# EAGLE design MRCS-8xDPDT-Relay (EAGLE 7.7.0)
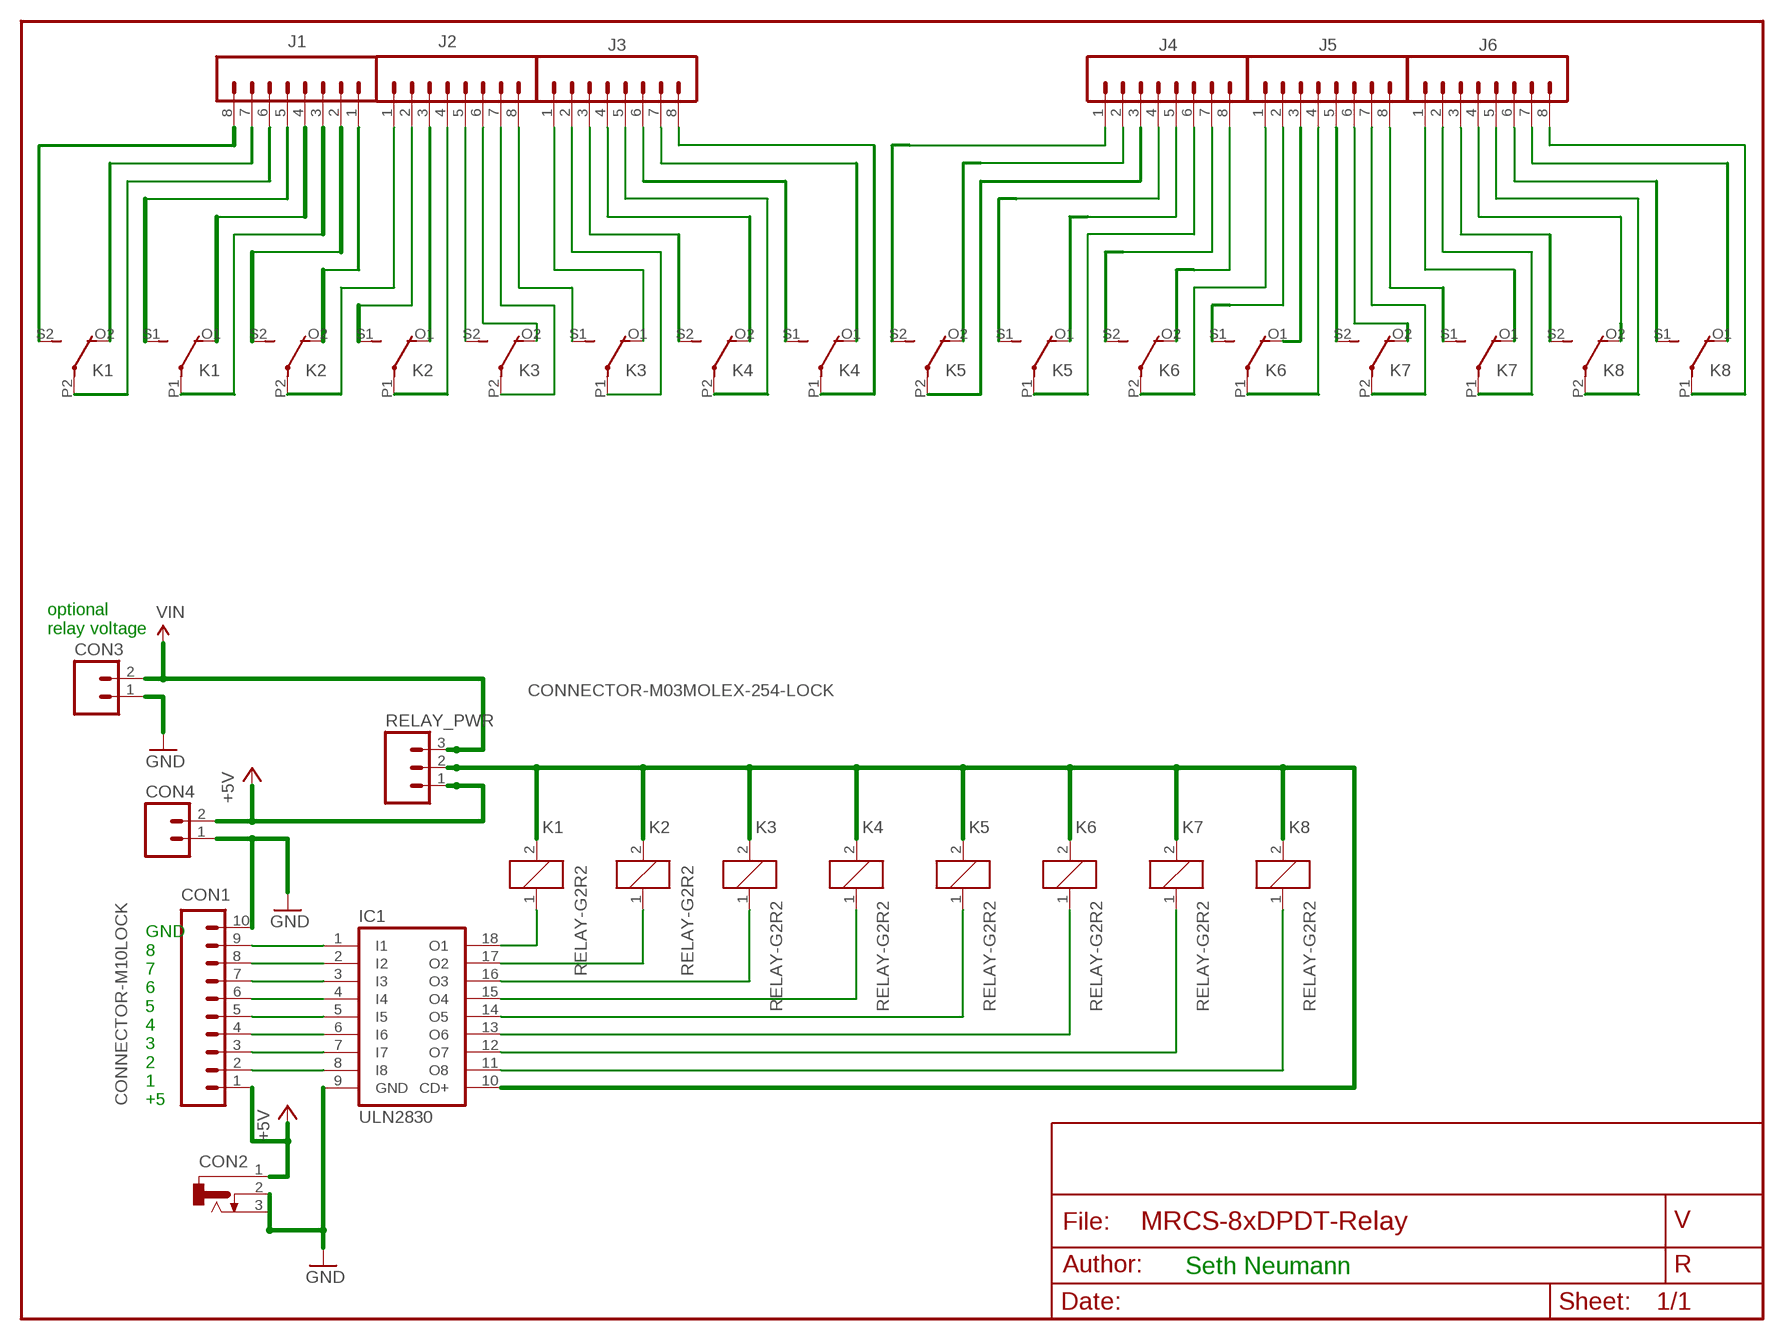
[diagram p0: schematic, sheet 1]

## Parts
CON1  CONNECTOR-M10LOCK  [1X10_LOCK]
CON2  CONNECTOR-DC-POWER-RA  [DCJ0202]
CON3  CONNECTOR-M023.5MM-LOCK  [SCREWTERMINAL-3.5MM-2_LOCK]
CON4  CONNECTOR-M023.5MM-LOCK  [SCREWTERMINAL-3.5MM-2_LOCK]
IC1  ULN2830  ULN2803A  [DIL18]
J1  CONNECTOR-M08LOCK  [1X08_LOCK]
J2  CONNECTOR-M08LOCK  [1X08_LOCK]
J3  CONNECTOR-M08LOCK  [1X08_LOCK]
J4  CONNECTOR-M08LOCK  [1X08_LOCK]
J5  CONNECTOR-M08LOCK  [1X08_LOCK]
J6  CONNECTOR-M08LOCK  [1X08_LOCK]
K1  RELAY-G2R2  [G2R2]
K2  RELAY-G2R2  [G2R2]
K3  RELAY-G2R2  [G2R2]
K4  RELAY-G2R2  [G2R2]
K5  RELAY-G2R2  [G2R2]
K6  RELAY-G2R2  [G2R2]
K7  RELAY-G2R2  [G2R2]
K8  RELAY-G2R2  [G2R2]
RELAY_PWR  CONNECTOR-M03MOLEX-254-LOCK  [MOLEX-1X3_LOCK]

## Nets
+5V: CON1.1 CON2.1 CON4.2(B) RELAY_PWR.1
GND: CON1.10 CON2.2 CON2.3 CON3.1(A) CON4.1(A) IC1.9(GND)
N$1: CON1.9 IC1.1(I1)
N$2: CON1.8 IC1.2(I2)
N$3: CON1.7 IC1.3(I3)
N$4: CON1.6 IC1.4(I4)
N$5: CON1.5 IC1.5(I5)
N$6: CON1.4 IC1.6(I6)
N$7: CON1.3 IC1.7(I7)
N$8: CON1.2 IC1.8(I8)
N$9: IC1.17(O2) K2.1
N$10: IC1.16(O3) K3.1
N$11: IC1.15(O4) K4.1
N$12: IC1.14(O5) K5.1
N$13: IC1.18(O1) K1.1
N$14: IC1.13(O6) K6.1
N$15: IC1.12(O7) K7.1
N$16: IC1.11(O8) K8.1
N$17: IC1.10(CD+) K1.2 K2.2 K3.2 K4.2 K5.2 K6.2 K7.2 K8.2 RELAY_PWR.2
N$18: J1.8 K1.S2(3:S)
N$19: J1.7 K1.O2(3:O)
N$20: J1.6 K1.P2(3:P)
N$21: J1.5 K1.S1(2:S)
N$22: J2.3 K2.O1(2:O)
N$23: J1.3 K1.P1(2:P)
N$24: J1.2 K2.S2(3:S)
N$25: J1.1 K2.O2(3:O)
N$26: J2.1 K2.P2(3:P)
N$27: J2.2 K2.S1(2:S)
N$28: J4.3 K5.P2(3:P)
N$29: J2.4 K2.P1(2:P)
N$30: J2.7 K3.P2(3:P)
N$31: J2.6 K3.O2(3:O)
N$32: J2.8 K3.S1(2:S)
N$33: J2.5 K3.S2(3:S)
N$34: J3.1 K3.O1(2:O)
N$35: J3.2 K3.P1(2:P)
N$36: J3.3 K4.S2(3:S)
N$37: J3.4 K4.O2(3:O)
N$38: J3.5 K4.P2(3:P)
N$39: J3.6 K4.S1(2:S)
N$40: J3.7 K4.O1(2:O)
N$41: J3.8 K4.P1(2:P)
N$42: J5.4 K6.P1(2:P)
N$43: J5.5 K7.S2(3:S)
N$44: J5.6 K7.O2(3:O)
N$45: J5.7 K7.P2(3:P)
N$46: J5.8 K7.S1(2:S)
N$47: J6.1 K7.O1(2:O)
N$48: J6.2 K7.P1(2:P)
N$49: J6.3 K8.S2(3:S)
N$50: J6.4 K8.O2(3:O)
N$51: J6.5 K8.P2(3:P)
N$52: J6.6 K8.S1(2:S)
N$53: J6.7 K8.O1(2:O)
N$54: J6.8 K8.P1(2:P)
N$55: J5.3 K6.O1(2:O)
N$56: J5.2 K6.S1(2:S)
N$57: J5.1 K6.P2(3:P)
N$58: J4.8 K6.O2(3:O)
N$59: J4.7 K6.S2(3:S)
N$60: J4.6 K5.P1(2:P)
N$61: J4.5 K5.O1(2:O)
N$62: J4.4 K5.S1(2:S)
N$64: J4.2 K5.O2(3:O)
N$65: J4.1 K5.S2(3:S)
N$66: J1.4 K1.O1(2:O)
VIN: CON3.2(B) RELAY_PWR.3

## Notes on the sheet
- optional 
  relay voltage
- GND
  8
  7
  6
  5
  4
  3
  2
  1
  +5
- Seth Neumann

## Library data of the parts
CON1 = SPCoast:CONNECTOR-M10: Header 10 Standard 10-pin 0.1" header. Use with straight break away headers (SKU : PRT-00116), right angle break away headers (PRT-00553), swiss pins (PRT-00743), machine pins (PRT-00117), and female headers (PRT-00115).
CON2 = SPCoast:CONNECTOR-DC-POWER: DC POWER JACK
CON3 CON4 = SPCoast:CONNECTOR-M02: PHOENIX CONNECTOR
IC1 = MRCS:ULN2803A: DRIVER ARRAY
J1-J6 = SPCoast:CONNECTOR-M08: Header 8 Standard 8-pin 0.1" header. Use with straight break away headers (SKU : PRT-00116), right angle break away headers (PRT-00553), swiss pins (PRT-00743), machine pins (PRT-00117), and female headers (PRT-00115).
K1-K8 = SPCoast:RELAY-G2R2: RELAY 2 x switch, Omron; MF: OMRON COMPONENTS USA; MPN: G2R-2-DC6; OC_FARNELL: unknown; OC_NEWARK: 89C5317
RELAY_PWR = SPCoast:CONNECTOR-M03

## Board
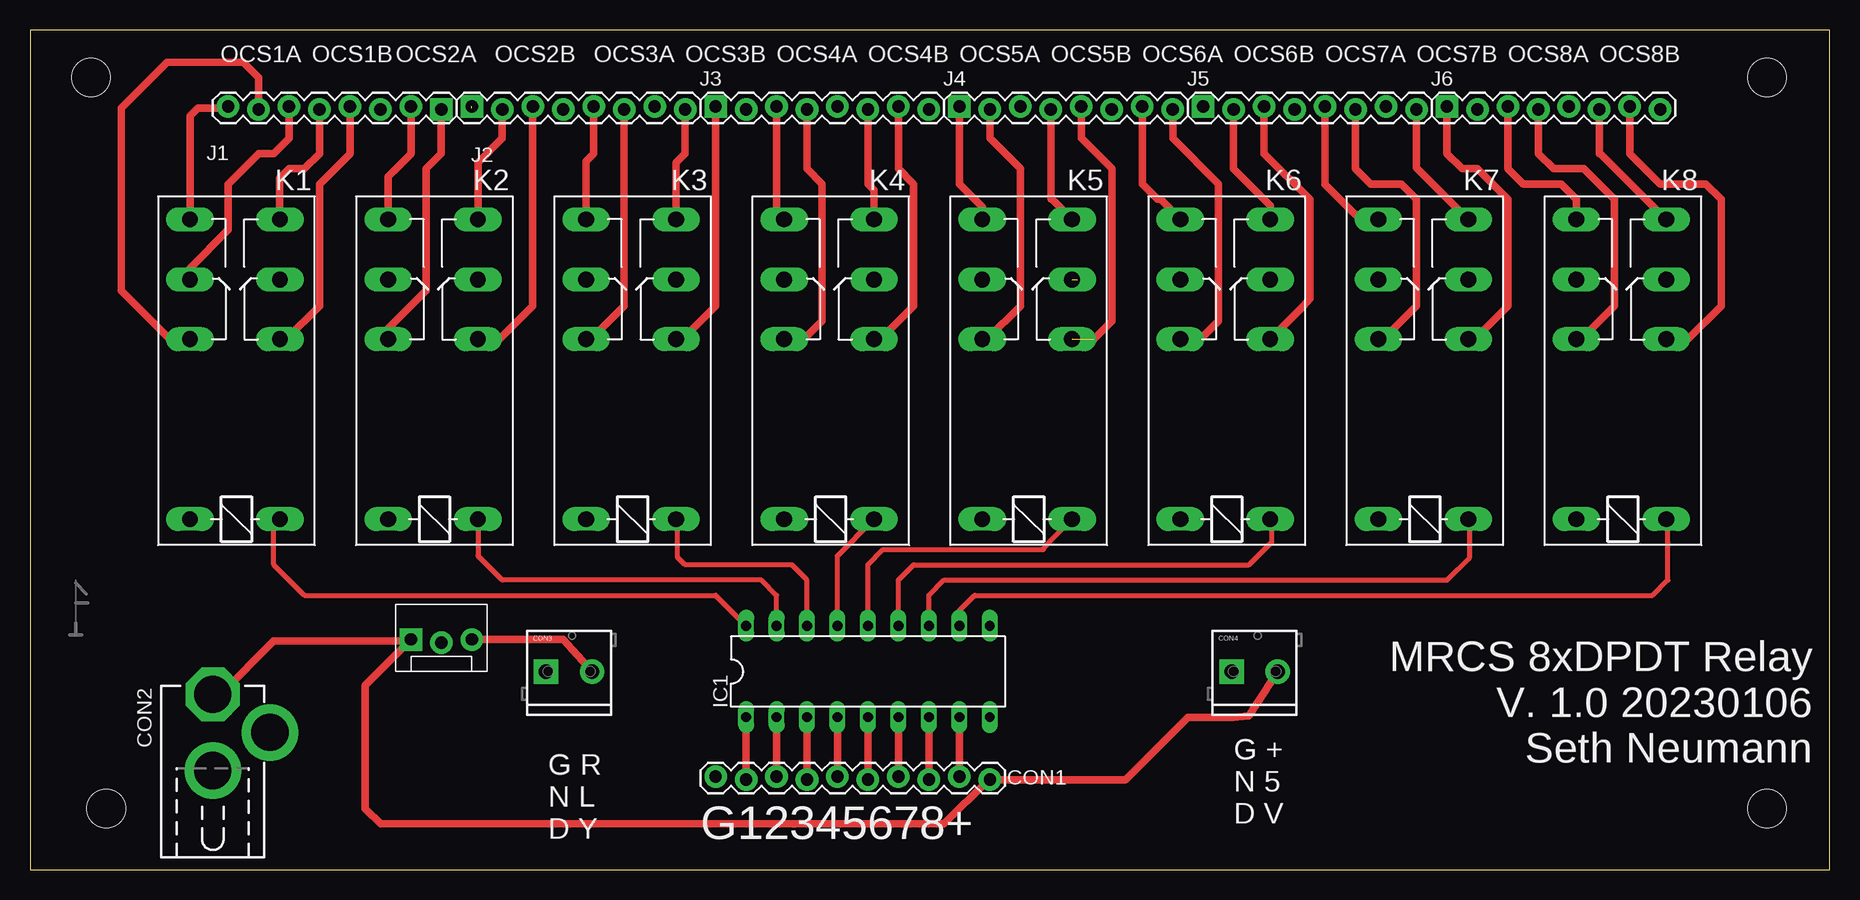
[diagram p1: board, top side]
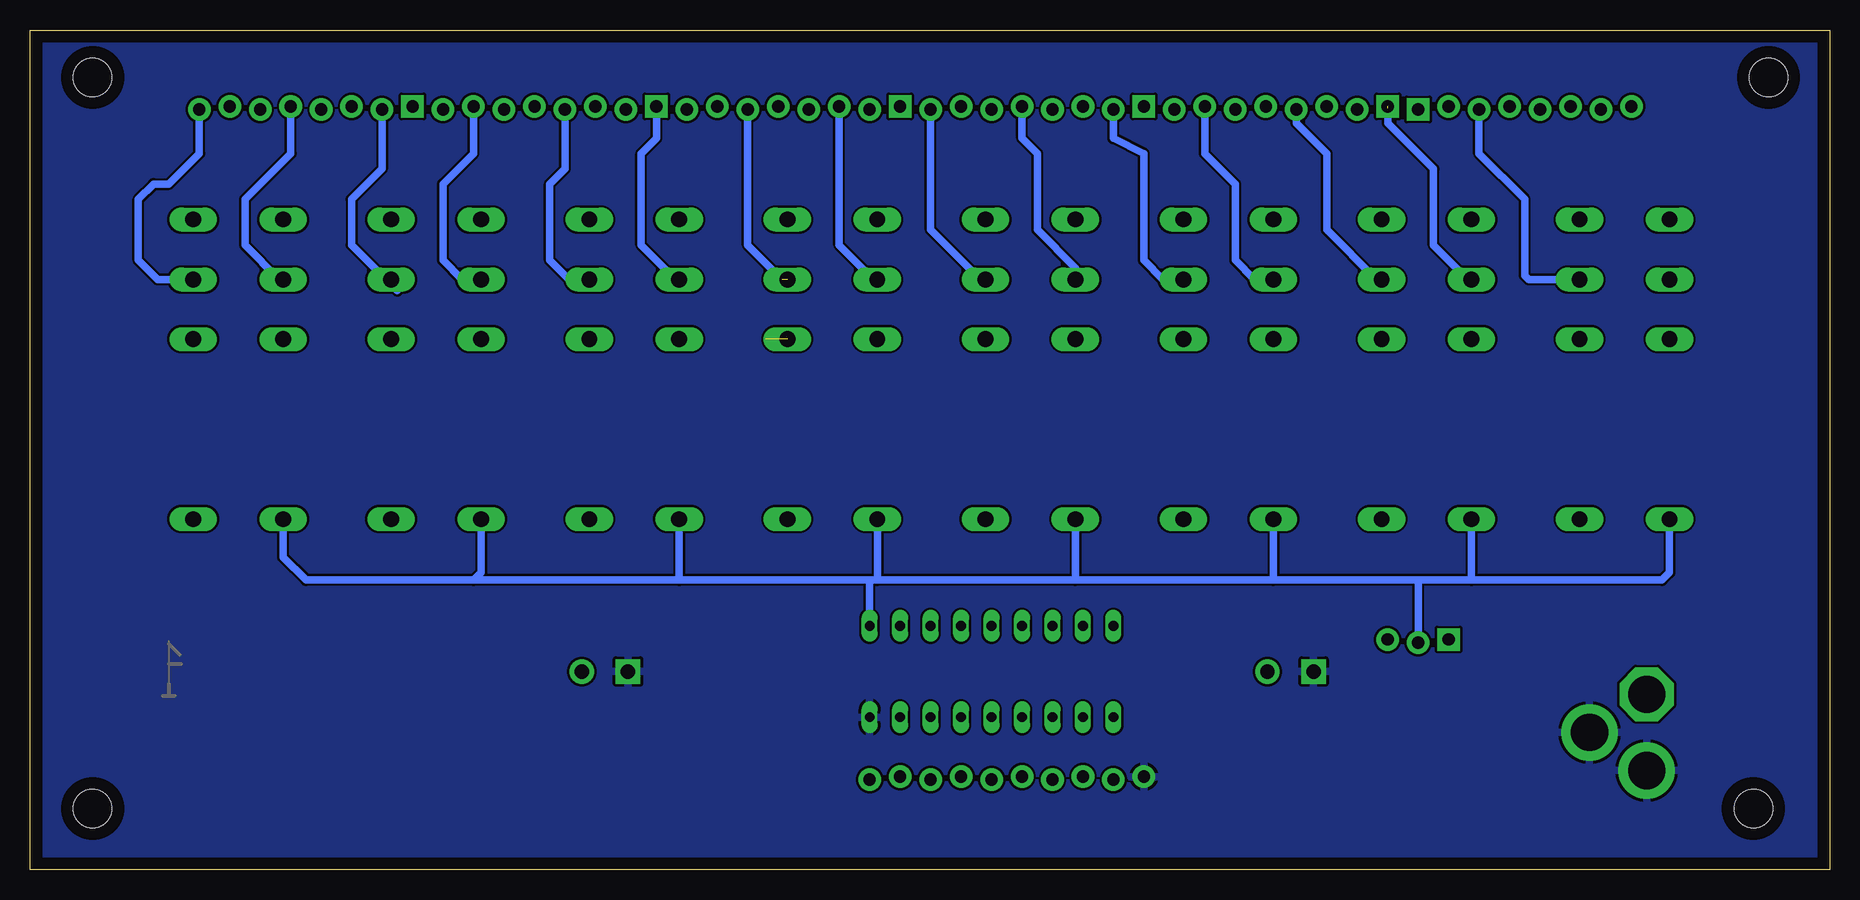
[diagram p2: board, bottom side, seen from below]

Size 150 x 70 mm. Coordinates in mm from the lower left corner, seen from the top.
Outline: 0,0 150,0 150,70 0,70 0,0
Copper layers (1*16): Top 0.035mm / dielectric 1.5mm / Bottom 0.035mm
Design rules "default": minimum track width 10mil, minimum drill 24mil, track to track 8mil, track to pad 8mil, pad to pad 8mil, via to via 8mil, smd to smd 8mil, copper to edge 40mil, drill to drill 8mil, minimum pad ring 10mil, minimum via ring 8mil, stop-mask expansion 4mil, vias tented up to drill 0mil, thermal gap 10mil
Holes 3.2 mm at 5.08,66.04 6.35,5.08 144.78,5.08 144.78,66.04

### Footprints (pad centres in the part's own frame; a part is rotated, then mirrored left to right if it is on the bottom)
1X10_LOCK = drill 1.016 pad 1.88: 1 0,0.127; 2 2.54,-0.127; 3 5.08,0.127; 4 7.62,-0.127; 5 10.16,0.127; 6 12.7,-0.127; 7 15.24,0.127; 8 17.78,-0.127; 9 20.32,0.127; 10 22.86,-0.127
DCJ0202 = drill 3.1 pad 4.5 octagon: 1 0,3.175 | drill 3.1 pad 4.7: 2 4.763,0; 3 0,-3.175
SCREWTERMINAL-3.5MM-2_LOCK = drill 1.2 pad 2.032 square: 1 -0.178,0 | drill 1.2 pad 2.032: 2 3.678,0
DIL18 = drill 0.813 long: 1 -10.16,-3.81; 2 -7.62,-3.81; 3 -5.08,-3.81; 4 -2.54,-3.81; 5 0,-3.81; 6 2.54,-3.81; 7 5.08,-3.81; 8 7.62,-3.81; 9 10.16,-3.81; 10 10.16,3.81; 11 7.62,3.81; 12 5.08,3.81; 13 2.54,3.81; 14 0,3.81; 15 -2.54,3.81; 16 -5.08,3.81; 17 -7.62,3.81; 18 -10.16,3.81
1X08_LOCK = drill 1.016 pad 1.88 square: 1 0,0.127 | drill 1.016 pad 1.88: 2 2.54,-0.127; 3 5.08,0.127; 4 7.62,-0.127; 5 10.16,0.127; 6 12.7,-0.127; 7 15.24,0.127; 8 17.78,-0.127
G2R2 = drill 1.321 long: 1 -11.43,-3.683; 2 -11.43,3.81; O1 3.581,-3.683; O2 3.581,3.81; P1 8.56,-3.683; P2 8.56,3.81; S1 13.564,-3.683; S2 13.564,3.81
MOLEX-1X3_LOCK = drill 1.016 pad 1.88 square: 1 0,0.127 | drill 1.016 pad 1.88: 2 2.54,-0.127; 3 5.08,0.127

### Placement (x,y rotation side)
CON1  80.01,7.62 180 top
CON2  15.24,11.43 0 top
CON3  43.18,16.51 0 top
CON4  100.33,16.51 0 top
IC1  69.85,16.51 0 top
J1  34.29,63.5 180 top
J2  36.83,63.5 0 top
J3  57.15,63.5 0 top
J4  77.47,63.5 0 top
J5  97.79,63.5 0 top
J6  118.11,63.5 0 top
K1  17.14,40.64 90 top
K2  33.66,40.64 90 top
K3  50.16,40.64 90 top
K4  66.67,40.64 90 top
K5  83.19,40.64 90 top
K6  99.69,40.64 90 top
K7  116.2,40.64 90 top
K8  132.72,40.64 90 top
RELAY_PWR  31.75,19.05 0 top
U$1  [CA-PROP65WARNING]  109.22,8.89 0 top
U$2  [MRCSLOGOBTM]  132.08,13.97 0 top
U$3  [MRCSLOGOTOP]  2.54,19.05 0 top

### Tracks (layer width: path | path; a pad name or v marks a point on that pad's centre or on a via)
+5V
  Top 0.61: CON4.2 101.6,12.83 100.33,12.7 96.52,12.7 91.31,7.49 CON1.1 79.88,7.49 76.2,3.81 29.21,3.81 27.94,5.08 27.94,15.37 RELAY_PWR.1 31.62,19.05 20.32,19.05 15.88,14.61 CON2.1
GND
  pour Bottom: 0,0 149.86,0 149.86,69.85 0,69.85
  pour Bottom (isolate 0.254): 0,0 149.86,0 149.86,69.85 0,69.85
N$1
  Top 0.61: IC1.1 CON1.9
N$2
  Top 0.61: IC1.2 CON1.8
N$3
  Top 0.61: IC1.3 CON1.7
N$4
  Top 0.61: IC1.4 CON1.6
N$5
  Top 0.61: IC1.5 CON1.5
N$6
  Top 0.61: IC1.6 CON1.4
N$7
  Top 0.61: IC1.7 CON1.3
N$8
  Top 0.61: IC1.8 CON1.2
N$9
  Top 0.406: K2.1 37.34,26.16 39.37,24.13 60.96,24.13 62.23,22.86 IC1.17
N$10
  Top 0.406: K3.1 53.98,29.08 53.98,26.04 54.61,25.4 63.5,25.4 64.77,24.13 IC1.16
N$11
  Top 0.406: IC1.15 67.31,26.16 K4.1
N$12
  Top 0.406: IC1.14 69.85,25.4 71.12,26.67 84.45,26.67 85.09,27.43 K5.1
N$13
  Top 0.406: K1.1 20.32,28.7 20.32,25.4 22.86,22.86 57.15,22.86 IC1.18
N$14
  Top 0.406: IC1.13 72.39,24.13 73.66,25.4 101.6,25.4 103.5,27.3 103.5,29.08 K6.1
N$15
  Top 0.406: IC1.12 74.93,22.86 76.2,24.13 118.11,24.13 120.02,26.04 120.02,29.08 K7.1
N$16
  Top 0.406: IC1.11 77.47,21.59 78.74,22.86 135.25,22.86 136.53,24.13 136.53,29.08 K8.1
N$17
  Bottom 0.61: K1.2 13.34,24.77 13.97,24.13 29.84,24.13 | 29.84,24.13 34.29,24.13 | 34.29,24.13 46.35,24.13 | 46.35,24.13 62.87,24.13 | 62.87,24.13 79.38,24.13 | 79.38,24.13 80.01,24.13 | 80.01,24.13 95.89,24.13 | 95.89,24.13 113.03,24.13 | 113.03,24.13 127,24.13 128.91,26.04 K8.2 | K7.2 112.39,24.77 113.03,24.13 | K6.2 95.89,24.13 | K5.2 79.38,24.13 | IC1.10 80.01,24.13 | K4.2 62.87,24.13 | 46.99,29.21 K3.2 46.35,24.13 | RELAY_PWR.2 34.29,24.13 | K2.2 29.84,24.13
N$18
  Top 0.61: K1.S2 13.34,62.87 13.97,63.5 16.38,63.5 J1.8
N$19
  Top 0.61: K1.O2 11.66,44.22 7.62,48.26 7.62,63.5 11.43,67.31 17.78,67.31 19.05,66.04 J1.7
N$20
  Top 0.61: K1.P2 13.34,50.16 16.51,53.34 16.51,57.15 19.05,59.69 20.32,59.69 21.59,60.96 J1.6
N$21
  Top 0.61: K1.S1 20.83,57.66 21.59,58.42 22.86,58.42 24.13,59.69 J1.5
N$22
  Top 0.61: K2.O1 39.14,44.22 41.91,46.99 J2.3
N$23
  Bottom 0.61: K1.P1 25.07,49.2 25.4,49.53 25.4,55.88 29.21,59.69 J1.3
N$24
  Top 0.61: K2.S2 29.84,57.78 31.75,59.69 J1.2
N$25
  Top 0.61: K2.O2 29.84,45.09 33.02,48.26 33.02,58.42 34.29,59.69 J1.1
N$26  (1 unrouted)
  Bottom 0.61: K2.P2 30.15,49.2 33.02,52.07 33.02,58.42 36.83,62.23 36.83,63.5
N$27
  Top 0.61: K2.S1 37.34,58.93 39.37,60.96 J2.2
N$28
  Bottom 0.61: K5.P2 79.68,49.2 82.55,52.07 J4.3
N$29
  Bottom 0.61: K2.P1 37.77,49.2 41.91,53.34 41.91,59.69 44.45,62.23 J2.4
N$30
  Bottom 0.61: K3.P2 47.93,49.2 49.53,50.8 49.53,57.15 52.07,59.69 J2.7
N$31
  Top 0.61: K3.O2 46.76,44.22 49.53,46.99 J2.6
N$32
  Top 0.61: K3.S1 53.85,58.93 54.61,59.69 J2.8
N$33
  Top 0.61: K3.S2 46.35,59.05 46.99,59.69 J2.5
N$34
  Top 0.61: K3.O1 54.38,44.22 57.15,46.99 J3.1
N$35
  Bottom 0.61: K3.P1 55.55,49.2 57.15,50.8 57.15,59.69 59.69,60.96 J3.2
N$36
  Top 0.61: J3.3 62.23,54.84 K4.S2
N$37
  Top 0.61: K4.O2 64.54,44.22 66.04,45.72 66.04,57.15 64.77,58.42 J3.4
N$38
  Bottom 0.61: K4.P2 62.87,50.16 66.04,53.34 66.04,59.69 67.31,60.96 J3.5
N$39
  Top 0.61: K4.S1 70.36,56.64 69.85,57.15 J3.6
N$40
  Top 0.61: K4.O1 70.89,44.22 73.66,46.99 73.66,57.15 72.39,58.42 J3.7
N$41
  Bottom 0.61: K4.P1 70.79,49.2 74.93,53.34 J3.8
N$42
  Bottom 0.61: K6.P1 105.08,49.2 106.68,50.8 106.68,57.15 105.41,58.42 J5.4
N$43
  Top 0.61: J5.5 107.95,57.15 110.49,54.61 111.99,54.61 K7.S2
N$44
  Top 0.61: K7.O2 112.8,44.22 115.57,46.99 115.57,55.88 114.3,57.15 111.76,57.15 110.49,58.42 J5.6
N$45
  Bottom 0.61: K7.P2 113.97,49.2 115.57,50.8 115.57,57.15 113.03,59.69 J5.7
N$46
  Top 0.61: J5.8 115.57,58.52 K7.S1
N$47
  Top 0.61: K7.O1 120.42,44.22 123.19,46.99 123.19,55.88 120.65,58.42 119.38,58.42 118.11,59.69 J6.1
N$48
  Bottom 0.61: J6.2 120.65,58.42 123.19,55.88 123.19,52.07 119.38,48.26 119.38,48.69 K7.P1
N$49
  Top 0.61: J6.3 123.19,58.42 124.46,57.15 127.64,57.15 128.91,55.88 K8.S2
N$50
  Top 0.61: K8.O2 129.31,44.22 132.08,46.99 132.08,55.88 129.54,58.42 127,58.42 125.73,59.69 J6.4
N$51
  Bottom 0.61: K8.P2 129.21,49.2 132.08,52.07 132.08,55.88 128.27,59.69 J6.5
N$52
  Top 0.61: J6.6 130.81,59.69 130.91,59.69 K8.S1
N$53
  Top 0.61: K8.O1 138.2,44.22 140.97,46.99 140.97,55.88 139.7,57.15 135.89,57.15 133.35,59.69 J6.7
N$54
  Bottom 0.61: K8.P1 139.37,49.2 140.97,50.8 140.97,55.88 139.7,57.15 138.43,57.15 135.89,59.69 J6.8
N$55
  Top 0.61: J5.3 102.87,59.69 106.68,55.88 106.68,47.62 106.15,46.99 K6.O1
N$56
  Top 0.61: K6.S1 103.38,55.37 100.33,58.42 J5.2
N$57
  Bottom 0.61: K6.P2 96.19,49.2 99.06,52.07 99.06,59.69 97.79,60.96 J5.1
N$58
  Top 0.61: K6.O2 97.56,44.22 99.06,45.72 99.06,57.15 95.25,60.96 J4.8
N$59
  Top 0.61: J4.7 92.71,57.15 93.98,55.88 94.21,55.88 K6.S2
N$60  (1 unrouted)
  Bottom 0.61: 87.3,49.2 90.17,52.07 J4.6
N$61  (1 unrouted)
  Top 0.61: 88.67,44.22 90.17,45.72 90.17,58.42 87.63,60.96 J4.5
N$62
  Top 0.61: J4.4 85.09,55.88 85.19,55.88 K5.S1
N$64
  Top 0.61: K5.O2 79.78,44.22 82.55,46.99 82.55,58.42 80.01,60.96 J4.2
N$65
  Top 0.61: J4.1 77.47,57.15 79.38,55.24 K5.S2
N$66
  Top 0.61: K1.O1 21.36,44.22 24.13,46.99 24.13,57.15 26.67,59.69 J1.4
VIN
  Top 0.61: RELAY_PWR.3 44.45,19.18 CON3.2

### Text on the board
tPlace: OCS1A | OCS1B | OCS2A | OCS2B | OCS3A | OCS3B | OCS4A | OCS4B | OCS5A | OCS5B | OCS6A | OCS6B | OCS7A | OCS7B | OCS8A | OCS8B | MRCS 8xDPDT Relay / V. 1.0 20230106 / Seth Neumann | G + / N 5 / D V | G R / N L / D Y | G12345678+